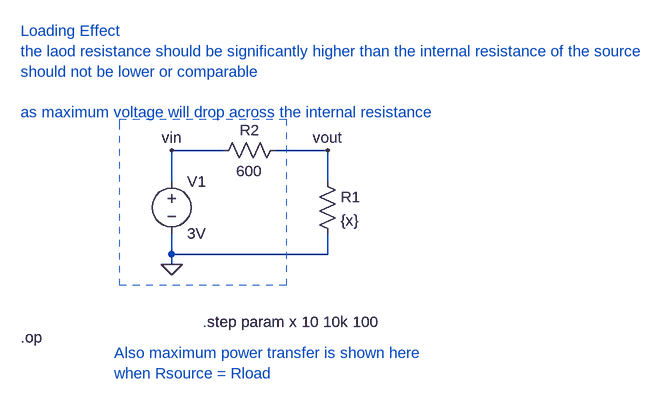
[diagram p0: schematic understanding_loading.asc]
understanding_loading.asc, the LTspice schematic file:
Version 4.1
SHEET 1 1160 680
WIRE 144 80 64 80
WIRE 304 80 224 80
WIRE 64 128 64 80
WIRE 304 128 304 80
WIRE 64 240 64 208
WIRE 304 240 304 208
WIRE 304 240 64 240
WIRE 64 256 64 240
FLAG 64 256 0
FLAG 304 80 vout
FLAG 64 80 vin
SYMBOL voltage 64 112 R0
WINDOW 123 0 0 Left 0
WINDOW 39 0 0 Left 0
SYMATTR InstName V1
SYMATTR Value 3V
SYMBOL res 288 112 R0
SYMATTR InstName R1
SYMATTR Value {x}
SYMBOL res 240 64 R90
WINDOW 0 0 56 VBottom 2
WINDOW 3 32 56 VTop 2
SYMATTR InstName R2
SYMATTR Value 600
TEXT -168 -104 Left 2 ;Loading Effect\nthe laod resistance should be significantly higher than the internal resistance of the source\nshould not be lower or comparable\n \nas maximum voltage will drop across the internal resistance
TEXT 112 344 Left 2 !.step param x 10 10k 100
TEXT -168 368 Left 2 !.op
TEXT -24 392 Left 2 ;Also maximum power transfer is shown here\nwhen Rsource = Rload
LINE Normal -16 288 -16 48 2
LINE Normal 240 288 -16 288 2
LINE Normal 240 32 240 288 2
LINE Normal -16 32 240 32 2
LINE Normal -16 48 -16 32 2

The netlist it stands for:
* understanding_loading.asc
V1 vin 0 3V
R1 vout 0 {x}
R2 vout vin 600
* Loading Effect
* the laod resistance should be significantly higher than the internal resistance of the source
* should not be lower or comparable
* as maximum voltage will drop across the internal resistance
.step param x 10 10k 100
.op
* Also maximum power transfer is shown here
* when Rsource = Rload
.backanno
.end

* Results of the author's LTspice run, read from the files saved beside the schematic
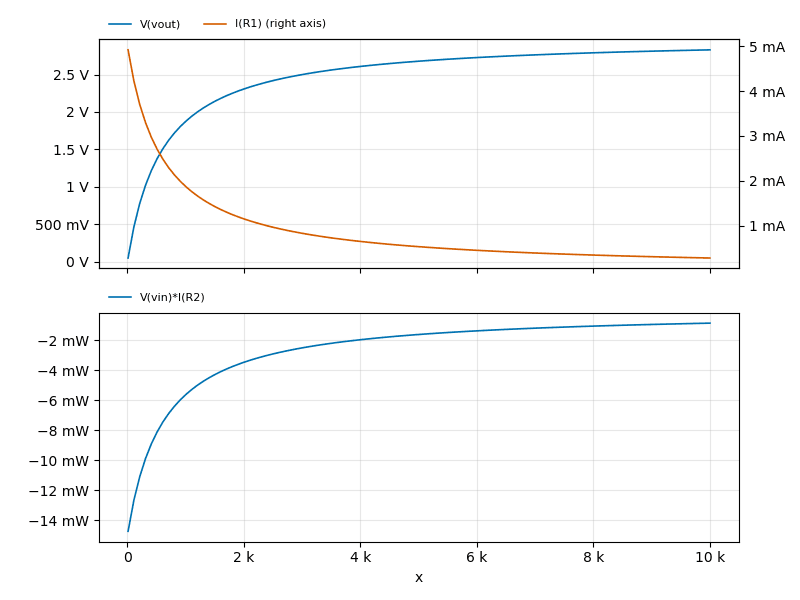
[diagram p1: Operating Point of understanding_loading.asc, plotted from the saved traces]
* Operating Point, 1 run:
*   V(vout): 49.18 mV at x=10 , 2.83 V at x=10 k, min 49.18 mV, max 2.83 V
*   I(R1): 4.918 mA at x=10 , 283 µA at x=10 k, min 283 µA, max 4.918 mA
*   V(vin)*I(R2): -14.75 mW at x=10 , -849.1 µW at x=10 k, min -14.75 mW, max -849.1 µW